# Altium schematic sheet Electronic Scheme to Resert Circuit_2021-10-20.schdoc
size 195 x 137 mm
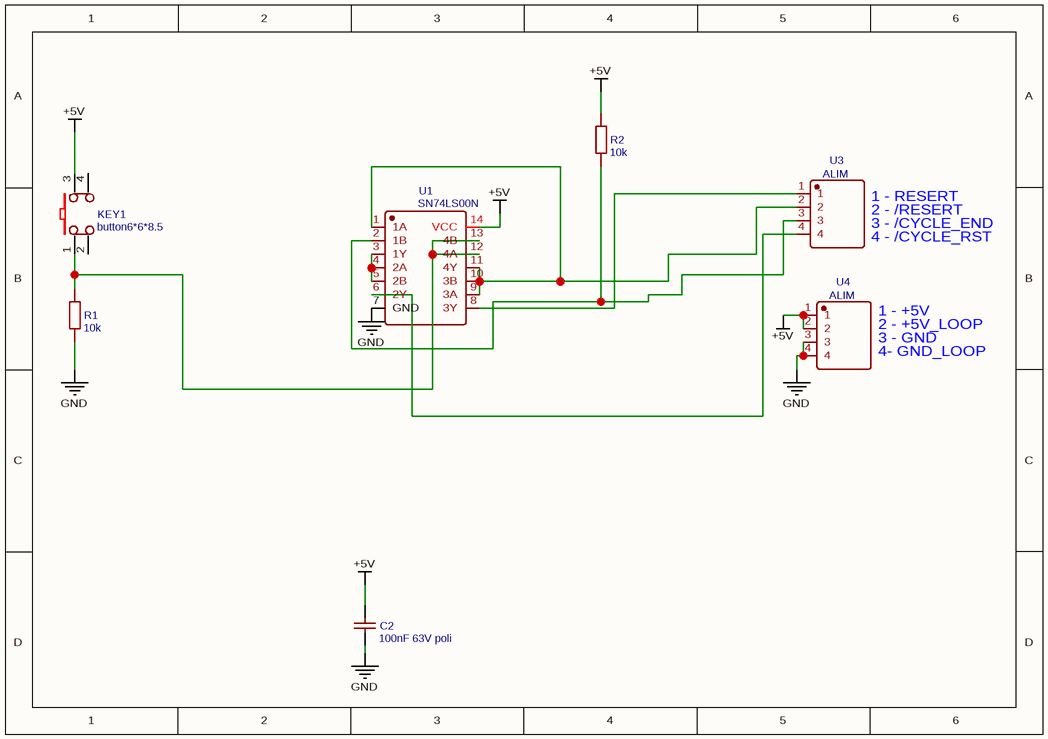
[diagram p0: Electronic Scheme to Resert Circuit_2021-10-20.schdoc]

## Parts
C2  100nF 63V poli  [CAP-TH_L5.5-W3.0-P5.00-D0.5]
KEY1  button6*6*8.5  [KEY-TH_4P-L6.0-W6.0-P4.50]
R1  10k  [RES-TH_BD2.3-L6.5-P10.50-D0.5]
R2  10k  [RES-TH_BD2.3-L6.5-P10.50-D0.5]
U1  SN74LS00N  [PDIP-14_L19.7-W6.6-P2.54-LS8.3-BL]
U3  ALIM  [HDR-TH_4P-P2.54-D1.0]
U4  ALIM  [HDR-TH_4P-P2.54-D1.0]

## Nets
+5V: C2.1 KEY1.3 R2.1 U1.14(VCC) U4.1 U4.2
GND: C2.2 R1.2 U1.7(GND) U4.3 U4.4
NetKEY1_1: KEY1.1 R1.1 U1.12(4A) U1.13(4B)
NetR2_2: R2.2 U1.2(1B) U3.3
NetU1_1: U1.1(1A) U1.9(3A) U1.10(3B) U1.11(4Y) U3.2
NetU1_3: U1.3(1Y) U1.4(2A) U1.5(2B)
NetU1_6: U1.6(2Y) U3.4
NetU1_8: U1.8(3Y) U3.1

Not connected (* = marked no-connect by the designer): KEY1 2 4

## Notes on the sheet
- 1 - RESERT
- 2 - /RESERT
- 3 - /CYCLE_END
- 4 - /CYCLE_RST
- 2 - +5V_LOOP
- 3 - GND
- 1 - +5V
- 4- GND_LOOP

## Library data of the parts
C2 = 100nF 63V poli: BOM_Manufacturer: ReliaPro; BOM_Manufacturer Part: 0.01uF(103) 100V; nameAlias: Capacitance; BOM_Supplier: LCSC; BOM_Supplier Part: C10722; spicePre: C; spiceSymbolName: 0.01uF(103) 100V
KEY1 = button6*6*8.5: BOM_Manufacturer: ReliaPro; BOM_Supplier Part: C59980; BOM_Supplier: LCSC; BOM_Manufacturer Part: button6*6*8.5; spicePre: K; spiceSymbolName: button6*6*8.5
R1 R2 = 10k: BOM_Manufacturer: Chian Chia Elec; nameAlias: Resistance (Ohms); Contributor: LCSC; BOM_Supplier: LCSC; BOM_Supplier Part: C119997; BOM_Manufacturer Part: -; spicePre: R; spiceSymbolName: CF1/4W-3.9Ω±5% T52
U1 = SN74LS00N: BOM_Manufacturer: TI; Contributor: LCSC; BOM_Supplier: LCSC; BOM_Manufacturer Part: SN74LS00N; BOM_Supplier Part: C181629; BOM_JLCPCB Part Class: Extended Part; spicePre: U; spiceSymbolName: SN74LS00N
U3 U4 = ALIM: BOM_Manufacturer: TE Connectivity; BOM_Manufacturer Part: 171825-4; Contributor: LCSC; BOM_Supplier: LCSC; BOM_Supplier Part: C210162; BOM_JLCPCB Part Class: Extended Part; spicePre: U; spiceSymbolName: 171825-4